# Altium schematic sheet TEC_driver.SchDoc: Title
size 420 x 297 mm; Author: G.Kasprowicz; CompanyName: WUT ISE; DrawnBy: G.Kasprowicz; Organization: WUT ISE; Address1: PW ISE; Address2: Nowowiejska 15/19 00-665 Warsaw; Address3: gkasprow@gmail.com; Revision: 1.0; SheetNumber: -; SheetTotal: -; ModifiedBy: -; CheckedDate: -; Title2: Title2; DivGrp: WUT ISE; Designer: G.Kasprowicz; SPICEModelCacheRYPVXPCY: <root> / <DocumentId>RYPVXPCY</DocumentId> / </root>; ModifiedDate: -; ProjectName: Sensor Box
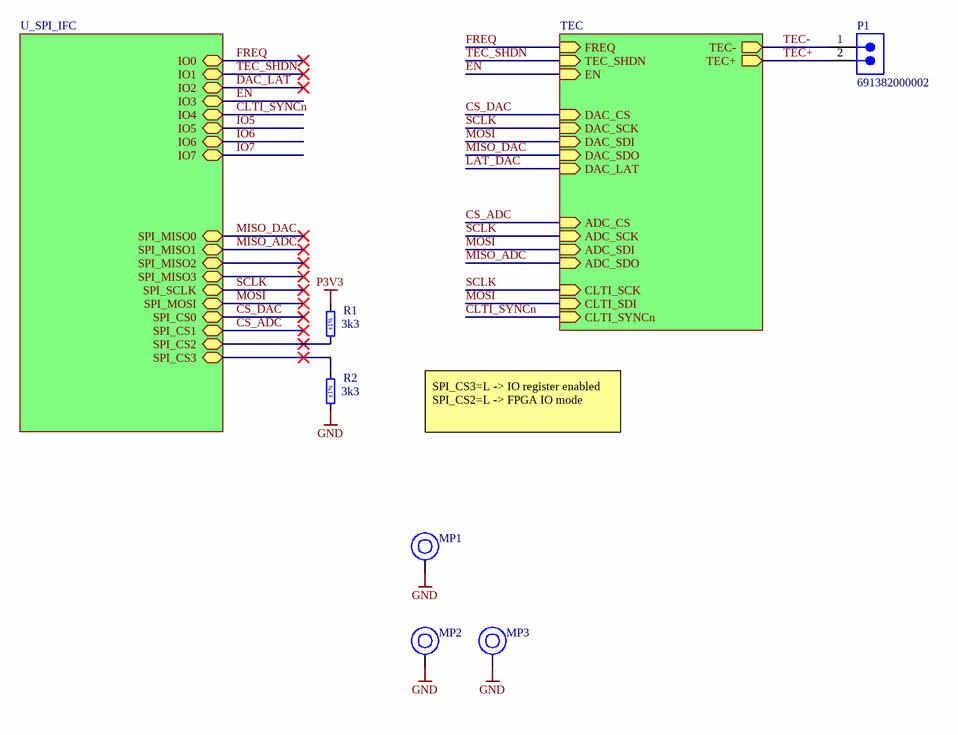
[diagram p0: TEC_driver.SchDoc]

## Parts
MP1  M1.6 x 3mm  [97730306330]  (value not drawn)
MP2  M1.6 x 3mm  [97730306330]  (value not drawn)
MP3  M1.6 x 3mm  [97730306330]  (value not drawn)
P1  691382000002  [691382000002]
R1  3k3  Tolerance: ±1%  [RESC1005X40N]
R2  3k3  Tolerance: ±1%  [RESC1005X40N]

## Sub-sheets
TEC = TEC.SchDoc: TEC+ (out), TEC- (out), FREQ (in), TEC_SHDN (in), DAC_CS (in), DAC_SCK (in), DAC_SDI (in), DAC_SDO (in), DAC_LAT (in), ADC_CS (in), ADC_SCK (in), ADC_SDI (in), ADC_SDO (in), EN (in), CLTI_SCK (in), CLTI_SDI (in), CLTI_SYNCn (in)
U_SPI_IFC = SPI_IFC.SchDoc: IO0 (bidir), IO1 (bidir), IO2 (bidir), IO3 (bidir), IO4 (bidir), IO5 (bidir), IO6 (bidir), IO7 (bidir), SPI_MISO0 (bidir), SPI_MISO1 (bidir), SPI_MISO2 (bidir), SPI_MISO3 (bidir), SPI_SCLK (bidir), SPI_MOSI (bidir), SPI_CS0 (bidir), SPI_CS1 (bidir), SPI_CS2 (bidir), SPI_CS3 (bidir)

## Nets
GND: MP1.1 MP2.1 MP3.1 R2.2
P3V3: R1.1
CLTI_SYNCn: sheet U_SPI_IFC/IO4, sheet TEC/CLTI_SYNCn
CS_ADC: sheet U_SPI_IFC/SPI_CS1, sheet TEC/ADC_CS
CS_DAC: sheet U_SPI_IFC/SPI_CS0, sheet TEC/DAC_CS
DAC_LAT: sheet U_SPI_IFC/IO2
EN: sheet U_SPI_IFC/IO3, sheet TEC/EN
FREQ: sheet U_SPI_IFC/IO0, sheet TEC/FREQ
IO5: sheet U_SPI_IFC/IO5
IO6: sheet U_SPI_IFC/IO6
IO7: sheet U_SPI_IFC/IO7
LAT_DAC: sheet TEC/DAC_LAT
MISO_ADC: sheet U_SPI_IFC/SPI_MISO1, sheet TEC/ADC_SDO
MISO_DAC: sheet U_SPI_IFC/SPI_MISO0, sheet TEC/DAC_SDO
MOSI: sheet U_SPI_IFC/SPI_MOSI, sheet TEC/DAC_SDI, sheet TEC/ADC_SDI, sheet TEC/CLTI_SDI
SCLK: sheet U_SPI_IFC/SPI_SCLK, sheet TEC/DAC_SCK, sheet TEC/ADC_SCK, sheet TEC/CLTI_SCK
TEC+: P1.2 ; sheet TEC/TEC+
TEC-: P1.1 ; sheet TEC/TEC-
TEC_SHDN: sheet U_SPI_IFC/IO1, sheet TEC/TEC_SHDN
NetR1_2: R1.2 ; sheet U_SPI_IFC/SPI_CS2
NetR2_1: R2.1 ; sheet U_SPI_IFC/SPI_CS3

## Notes on the sheet
- SPI_CS3=L -> IO register enabled
  SPI_CS2=L -> FPGA IO mode
- Project/Equipment
- Document
- Designer
- Drawn by
- Check.by
- Copyright WUT ISE 2018.
  This documentation describes Open Hardware and is licensed under the CERN OHL v.1.1. You may redistribute and modify this documentation under the terms of the CERN OHL v.1.1. (http://ohwr.org/CERNOHL). This documentation is distributed WITHOUT ANY EXPRESS OR IMPLIED WARRANTY, INCLUDING OF MERCHANTABILITY, SATISFACTORY QUALITY AND FITNESS FOR A PARTICULAR PURPOSE. Please see the CERN OHL v.1.1 for applicable conditions.
- Contact
- File
- Last Mod.
- Print Date
- Sheet
- Size
- A3
- of
- Rev

## Library data of the parts
MP1-MP3 = 97730306330R: WA-SMSI SMT Steel Spacer with internal Thread Bottom closed, OD 3.3mm, M1.6 x 3mm; Manufacturer: Wurth Elektronik; Inside Thread Length: 1.8mm; Surface: Tin; ComponentLink1Description: Website Link; ComponentLink1URL: https://www.we-online.com/redexpert/article/97730306330R?ad; ComponentLink2Description: Datasheet Link; ComponentLink2URL: https://www.we-online.com/redexpert/spec/97730306330R?ad; Manufacturer Part Number: 97730306330R; Category: SMT Spacers; Match Code: WA-SMSI; Mount: Surface Mount; Operating Temperature Max: 150°C; Operating Temperature Min: -55°C; Packaging: Tape and Reel; Height: 3mm; Material: Steel; Outside Diameter: 3.3mm; Thread Size: M1.6
P1 = 691382000002: WR-TBL Series 382 Vertical PCB Header, THT, pitch 2.5mm, 02p; Manufacturer: Wurth Elektronik; Modularity: No; Rated Current: 12A; System: Pluggable Connector; Working Voltage: 300V; Manufacturer Part Number: 691382000002; Category: Terminal Block; Match Code: WR-TBL; ComponentLink1Description: Website Link; ComponentLink1URL: https://www.we-online.com/redexpert/article/691382000002?ad; ComponentLink2Description: Datasheet Link; ComponentLink2URL: https://www.we-online.com/redexpert/spec/691382000002?ad; Mount: Through Hole; Min Operating Temperature: -40°C; Max Operating Temperature: 105°C; Packaging: Box; Application: Pluggable; Number of Pins: 2; Number of Rows: 1; Orientation: Vertical; Pitch: 2.5mm
R1 R2 = R0402_3K3_1%_0.0625W_100PPM: Resistor - 1%; Part Description: General Purpose Thick Film Chip Resistor; Manufacturer: GENERIC; Manufacturer1 Part Number: 232270673302L; TC: ±100ppm/°C; PressFit: No; Part Number: R0402_3K3_1%_0.0625W_100PPM; Component Kind: Standard; Component Type: Standard; Pin Count: 2; Value: 3k3; Status: Not Recommended; Power: 0.0625W; Manufacturer Part Number: R0402_3K3_1%_0.0625W_100PPM; Case: 0402; Mounted: Yes; Sense: No; Socket: No; SMD: Yes; Manufacturer1 Example: YAGEO PHYCOMP; Manufacturer1 ComponentHeight: 0.4mm; HelpURL: \\cern.ch\dfs\Applications\Altium\Datasheets\R0402_Phycomp_RC0402.pdf; Author: CERN DEM JLC; CreateDate: 03.12.2007; LatestRevisionDate: 17.10.2012